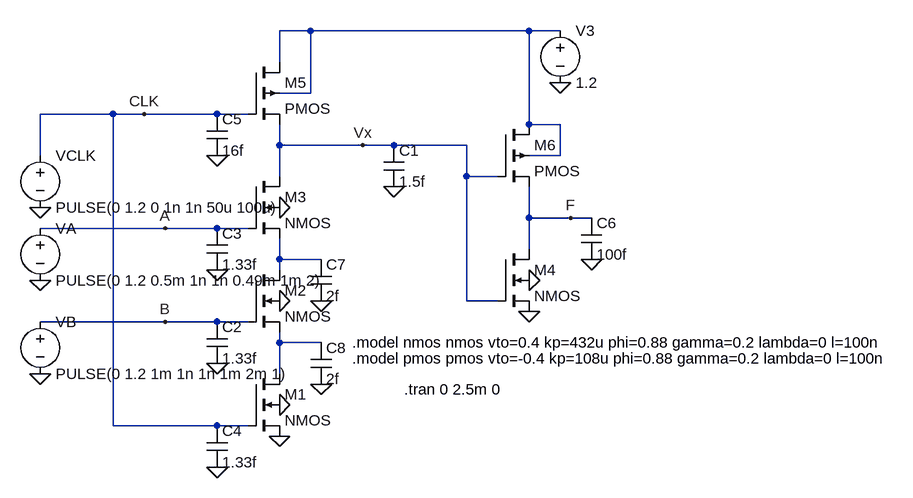
[diagram p0: schematic 380lab5b.asc]
380lab5b.asc, the LTspice schematic file:
Version 4
SHEET 1 1240 680
WIRE 288 -288 240 -288
WIRE 624 -288 288 -288
WIRE 672 -288 624 -288
WIRE 240 -240 240 -288
WIRE 288 -192 288 -288
WIRE 288 -192 240 -192
WIRE -16 -160 -128 -160
WIRE 32 -160 -16 -160
WIRE 144 -160 32 -160
WIRE 192 -160 144 -160
WIRE 624 -144 624 -288
WIRE 672 -144 624 -144
WIRE 240 -112 240 -144
WIRE 368 -112 240 -112
WIRE 416 -112 368 -112
WIRE 528 -112 416 -112
WIRE -128 -96 -128 -160
WIRE 672 -96 672 -144
WIRE 672 -96 624 -96
WIRE 240 -64 240 -112
WIRE 528 -64 528 -112
WIRE 576 -64 528 -64
WIRE 624 0 624 -48
WIRE 688 0 624 0
WIRE 720 0 688 0
WIRE 64 16 -128 16
WIRE 144 16 64 16
WIRE 192 16 144 16
WIRE 624 48 624 0
WIRE 240 64 240 32
WIRE 304 64 240 64
WIRE 240 80 240 64
WIRE 528 128 528 -64
WIRE 576 128 528 128
WIRE 64 160 -128 160
WIRE 144 160 64 160
WIRE 192 160 144 160
WIRE 240 192 240 176
WIRE 304 192 240 192
WIRE 240 240 240 192
WIRE -16 320 -16 -160
WIRE 144 320 -16 320
WIRE 192 320 144 320
FLAG 240 336 0
FLAG 240 288 0
FLAG 240 128 0
FLAG 240 -16 0
FLAG 624 96 0
FLAG 624 144 0
FLAG 416 -48 0
FLAG 672 -208 0
FLAG 144 80 0
FLAG 144 224 0
FLAG 144 -96 0
FLAG 144 384 0
FLAG 720 64 0
FLAG -128 -16 0
FLAG -128 96 0
FLAG -128 240 0
FLAG 688 0 F
FLAG 368 -112 Vx
FLAG 64 16 A
FLAG 64 160 B
FLAG 32 -160 CLK
FLAG 304 128 0
FLAG 304 256 0
SYMBOL nmos4 192 240 R0
SYMATTR InstName M1
SYMATTR Value2 w=0.67u
SYMBOL nmos4 192 80 R0
SYMATTR InstName M2
SYMATTR Value2 w=0.67u
SYMBOL nmos4 192 -64 R0
SYMATTR InstName M3
SYMATTR Value2 w=0.67u
SYMBOL nmos4 576 48 R0
SYMATTR InstName M4
SYMATTR Value2 w=0.1u
SYMBOL pmos4 192 -240 R0
SYMATTR InstName M5
SYMATTR Value2 w=8u
SYMBOL pmos4 576 -144 R0
SYMATTR InstName M6
SYMATTR Value2 w=0.4u
SYMBOL cap 400 -112 R0
SYMATTR InstName C1
SYMATTR Value 1.5f
SYMBOL voltage -128 144 R0
WINDOW 123 0 0 Left 2
WINDOW 39 0 0 Left 2
SYMATTR InstName VB
SYMATTR Value PULSE(0 1.2 1m 1n 1n 1m 2m 1)
SYMBOL voltage -128 0 R0
WINDOW 123 0 0 Left 2
WINDOW 39 0 0 Left 2
SYMATTR InstName VA
SYMATTR Value PULSE(0 1.2 0.5m 1n 1n 0.49m 1m 2)
SYMBOL voltage 672 -304 R0
SYMATTR InstName V3
SYMATTR Value 1.2
SYMBOL voltage -128 -112 R0
WINDOW 123 0 0 Left 2
WINDOW 39 0 0 Left 2
SYMATTR InstName VCLK
SYMATTR Value PULSE(0 1.2 0 1n 1n 50u 100u)
SYMBOL cap 128 160 R0
SYMATTR InstName C2
SYMATTR Value 1.33f
SYMBOL cap 128 16 R0
SYMATTR InstName C3
SYMATTR Value 1.33f
SYMBOL cap 128 320 R0
SYMATTR InstName C4
SYMATTR Value 1.33f
SYMBOL cap 128 -160 R0
SYMATTR InstName C5
SYMATTR Value 16f
SYMBOL cap 704 0 R0
SYMATTR InstName C6
SYMATTR Value 100f
SYMBOL cap 288 64 R0
SYMATTR InstName C7
SYMATTR Value 2f
SYMBOL cap 288 192 R0
SYMATTR InstName C8
SYMATTR Value 2f
TEXT 352 192 Left 2 !.model nmos nmos vto=0.4 kp=432u phi=0.88 gamma=0.2 lambda=0 l=100n
TEXT 352 216 Left 2 !.model pmos pmos vto=-0.4 kp=108u phi=0.88 gamma=0.2 lambda=0 l=100n
TEXT 432 264 Left 2 !.tran 0 2.5m 0

The netlist it stands for:
* 380lab5b.asc
M1 N003 CLK 0 0 NMOS w=0.67u
M2 N002 B N003 0 NMOS w=0.67u
M3 Vx A N002 0 NMOS w=0.67u
M4 F Vx 0 0 NMOS w=0.1u
M5 N001 CLK Vx N001 PMOS w=8u
M6 N001 Vx F N001 PMOS w=0.4u
C1 Vx 0 1.5f
VB B 0 PULSE(0 1.2 1m 1n 1n 1m 2m 1)
VA A 0 PULSE(0 1.2 0.5m 1n 1n 0.49m 1m 2)
V3 N001 0 1.2
VCLK CLK 0 PULSE(0 1.2 0 1n 1n 50u 100u)
C2 B 0 1.33f
C3 A 0 1.33f
C4 CLK 0 1.33f
C5 CLK 0 16f
C6 F 0 100f
C7 N002 0 2f
C8 N003 0 2f
.model NMOS NMOS
.model PMOS PMOS
.lib standard.mos
.model nmos nmos vto=0.4 kp=432u phi=0.88 gamma=0.2 lambda=0 l=100n
.model pmos pmos vto=-0.4 kp=108u phi=0.88 gamma=0.2 lambda=0 l=100n
.tran 0 2.5m 0
.backanno
.end